# Altium schematic sheet Power_Input.SchDoc: Power Input
size OrCAD A; DocumentNumber: LM-008; Revision: A; SheetNumber: 1; SheetTotal: 2; DocumentName: LM-008
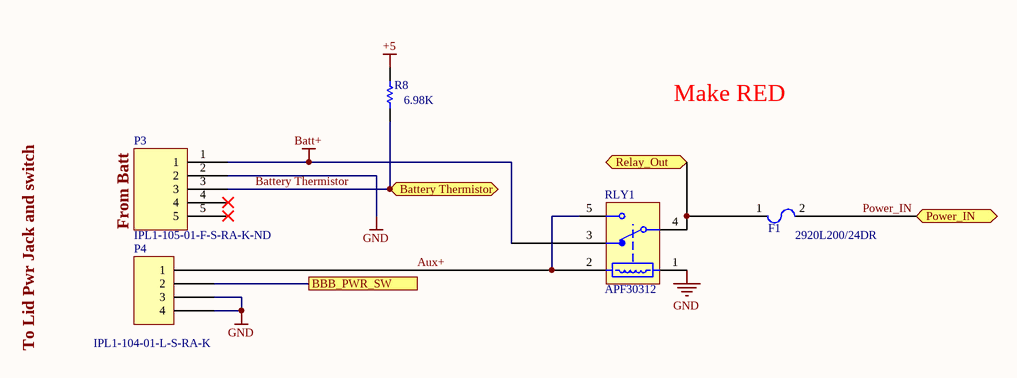
[diagram p0: Power_Input.SchDoc]

## Parts
F1  PCT  [CAPC7451X12N]  (value not drawn)
P3  Supplier Part Number 1: IPL1-105-01-F-S-RA-K-ND  [IPL1-105-01-F-S-RA]  (hidden comment: IPL1-105-01-F-S-RA)
P4  IPL1-104-01-L-S-RA-K  [IPL1-104-01-L-S-RA-K]
R8  6.98K  [RESC0402(1005)_L]
RLY1  APF30312  [PNSC-PF-5-2800x500x1500_V]

## Ports
Battery Thermistor, BBB_PWR_SW, Power_IN, Relay_Out

## Nets
+5: R8.2
Batt+: P3.1 RLY1.3(NC)
GND: P3.2 P4.3 P4.4 RLY1.1
Aux+: P4.1 RLY1.2 RLY1.5(NO)
Battery Thermistor: P3.3 R8.1 ; port Battery Thermistor
BBB_PWR_SW: P4.2 ; port BBB_PWR_SW
Power_IN: F1.2 ; port Power_IN
Relay_Out: F1.1 RLY1.4(COM) ; port Relay_Out

Not connected (* = marked no-connect by the designer): P3 4* 5*

## Notes on the sheet
- Make RED
- From Batt
- (near F1) 2920L200/24DR
- To Lid Pwr Jack and switch
- Title
- Size:
- Date:
- Orcad A
- Number:
- Time:
- Revision:
- Sheet
- of
- ZLS Corporation
- 7801 North Lamar Blvd.
- Suite E-184
- Austin, Texas 78752  USA
- (512) 453-0288
- File:

## Library data of the parts
P4 = IPL1-104-01-L-S-RA-K: Manufacturer: Samtec Inc.; Connector Type: Header; Pitch - Mating: 0.100" (2.54mm); Number of Positions: 4; Number of Positions Loaded: All; Style: Board to Cable/Wire; Shrouding: Shrouded - 4 Wall; Contact Length - Mating: 0.215" (5.46mm); Contact Length - Post: 0.085" (2.16mm); Material Flammability Rating: UL94 V-0; Voltage Rating: 675VAC, 954VDC; Supplier 1: Digi-Key; Supplier Part Number 1: SAM9597-ND; Manufacturer Part Number: IPL1-104-01-L-S-RA-K; RoHS: RoHS Compliant; Category: Connectors, Interconnects; Stock 1: 265; Pricing 1: 1=2.53, 10=2.424, 100=2.02, 500=1.717, 1000=1.4645, 5000=1.313 (USD); Packaging: Tube; Part Status: Active; Contact Type: Male Pin; Number of Rows: 1; Row Spacing - Mating: -; Mounting Type: Through Hole, Right Angle; Termination: Solder; Fastening Type: Locking Ramp; Overall Contact Length: -; Insulation Height: 0.240" (6.10mm); Contact Shape: Square; Contact Finish - Mating: Gold; Contact Finish Thickness - Mating: 10µin (0.25µm); Contact Finish - Post: Tin; Contact Material: Phosphor Bronze; Insulation Material: Liquid Crystal Polymer (LCP); Features: -; Operating Temperature: -55°C ~ 125°C; Ingress Protection: -; Insulation Color: Natural; Current Rating: -; Mated Stacking Heights: -; Contact Finish Thickness - Post: -; Applications: -; ComponentLink1URL: http://suddendocs.samtec.com/prints/ipl1-1xx-xx-xxx-s-xx-x-xx-mkt.pdf; ComponentLink1Description: http://suddendocs.samtec.com/prints/ipl1-1xx-xx-xxx-s-xx-x-xx-mkt.pdf
R8 = CMP-1011-00927-1: RES SMD 6.98K OHM 1% 1/16W 0402; Manufacturer: Yageo; Manufacturer Part Number: RC0402FR-076K98L; Power (Watts): 0.063W, 1/16W; Temperature Coefficient: ±100ppm/°C; Supplier 1: Digi-Key; Supplier Part Number 1: YAG3220CT-ND; RoHS: RoHS Compliant; Category: Resistors; Stock 1: 182255; Pricing 1: 1=0.1, 10=0.014, 100=0.0055, 1000=0.00247, 2500=0.00214, 5000=0.00177 (USD); Packaging: Cut Tape (CT); Part Status: Active; Tolerance: ±1%; Composition: Thick Film; Features: Moisture Resistant; Operating Temperature: -55°C ~ 155°C; Package / Case: 0402 (1005 Metric); Supplier Device Package: 0402; Size / Dimension: 0.039" L x 0.020" W (1.00mm x 0.50mm); Height - Seated (Max): 0.016" (0.40mm); Failure Rate: -; ComponentLink1URL: http://www.yageo.com/documents/recent/PYu-RC_Group_51_RoHS_L_7.pdf; ComponentLink1Description: http://www.yageo.com/documents/recent/PYu-RC_Group_51_RoHS_L_7.pdf
RLY1 = CMP-1503-00270-1: PF Relays, 12 V Coil Voltage, 170 mW Nominal Operating Power, -40 to 85 degC, 5-Pin PF, Tube, Case, RoHS; Manufacturer: Panasonic; Max Switching Voltage: 250 V AC; Nominal Operating Power: 170 mW; Electrical Life: 5x10^4 (N.O.), 3x10^4 (N.C.); Max Switching Current: 6 A; Coil Voltage: 12 V; Mechanical Life(Min.operation): 5x10^6; Pb-Free: True; ComponentLink3Description: Package Specification; ComponentLink1Description: Manufacturer URL; RoHS: True; ComponentLink3URL: http://www3.panasonic.biz/ac/e_download/control/relay/power/catalog/mech_eng_pf.pdf?f_cd=300412; PackageReference: PF-5-2800x500x1500; ComponentLink1URL: http://www3.panasonic.biz/ac/ae/index.jsp; ComponentLink2Description: Datasheet; Series: PF Relays; PartNumber: APF30312; PackageDescription: 5-Pin Through Hole Terminal Package, Body 28 x 5 mm; Packing: Tube, Case; DatasheetVersion: 201402-T; Mounting Technology: Through Hole; PackageVersion: ASCTB205E, 02/2014; ComponentLink2URL: http://www3.panasonic.biz/ac/e_download/control/relay/power/catalog/mech_eng_pf.pdf?f_cd=300412
P3 = IPL1-105-01-F-S-RA: Supplier 1: Digi-Key